# Altium schematic sheet power_PROTECTION.SchDoc: power_PROTECTION.SchDoc
size A4; Organization: Badgerloop; Address1: 133 Engineering Research; Address2: Building; Address3: Madison, WI 53715
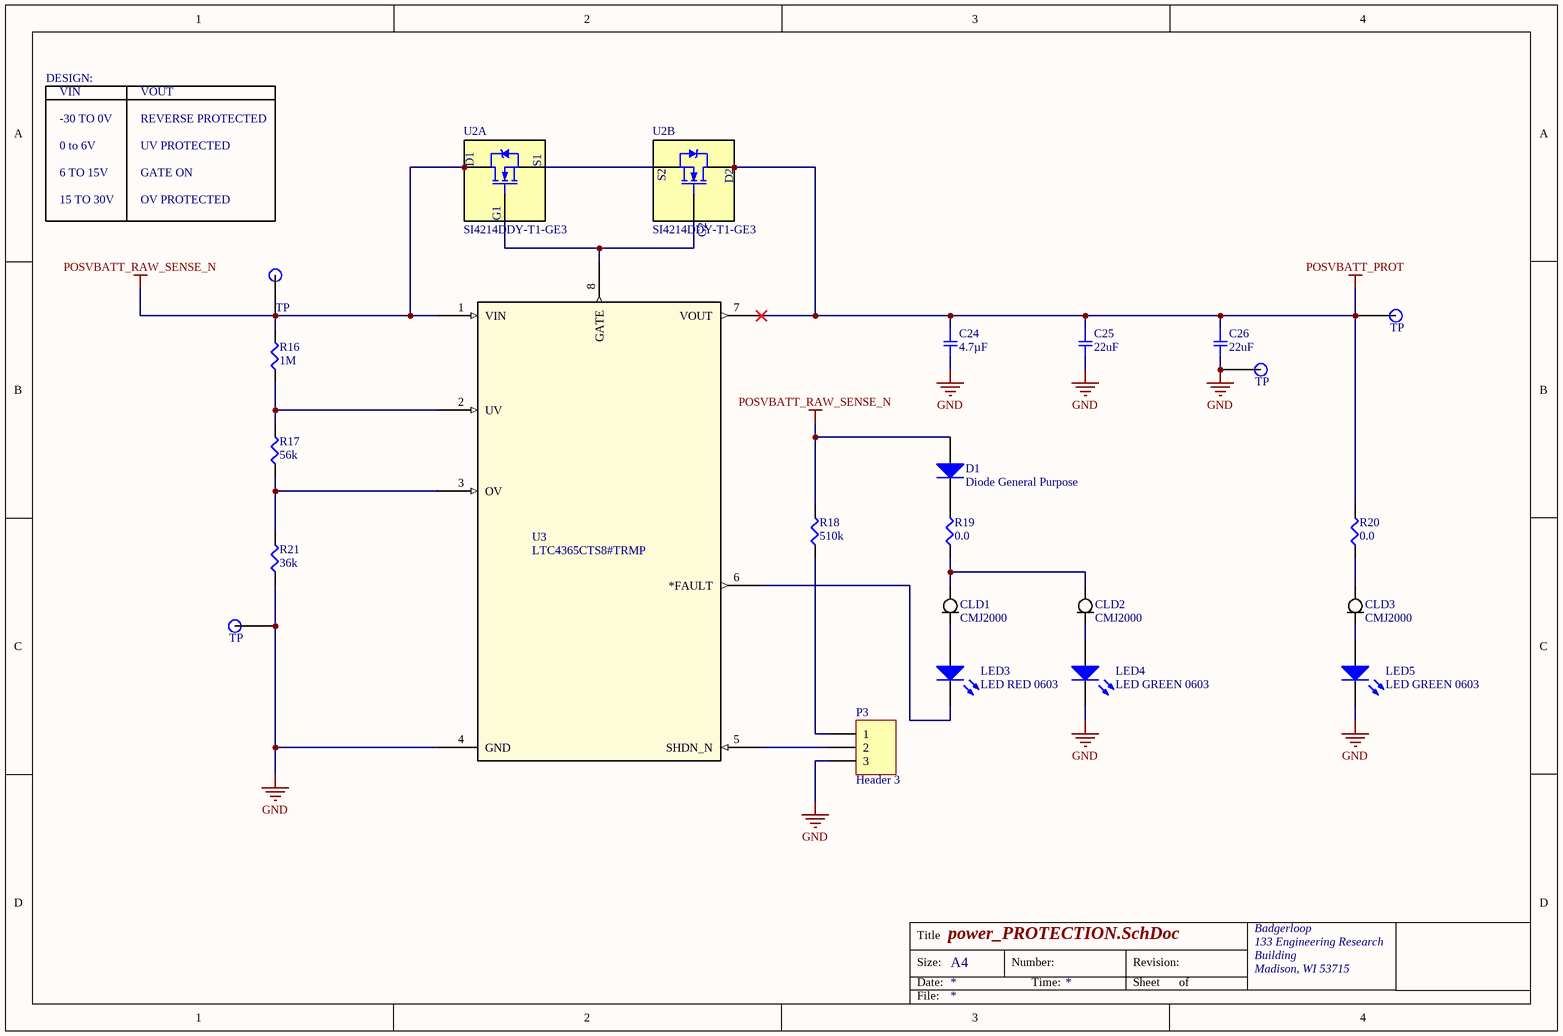
[diagram p0: power_PROTECTION.SchDoc]

## Parts
C24  4.7µF  [SMD-0805C]
C25  22uF  [SMD-0805C]
C26  22uF  [SMD-0805C]
CLD1  CMJ2000  [SODFL350X80-2N]
CLD2  CMJ2000  [SODFL350X80-2N]
CLD3  CMJ2000  [SODFL350X80-2N]
D1  Diode General Purpose  [Diode General Purpose]
LED3  LED RED 0603  [LED 0603 RED]
LED4  LED GREEN 0603  [LED 0603 GREEN]
LED5  LED GREEN 0603  [LED 0603 GREEN]
P3  Header 3  [Pin Header 1x3 TH Pitch 2.54mm]
R16  1M  [SMD-0402-RES]
R17  56k  [SMD-0402-RES]
R18  510k  [SMD-0402-RES]
R19  0.0  [SMD-0402-RES]
R20  0.0  [SMD-0402-RES]
R21  36k  [SMD-0402-RES]
TP9  TP  [Test Point]
TP10  TP  [Test Point]
TP11  TP  [Test Point]
TP13  TP  [Test Point]
U2  SI4214DDY-T1-GE3  [SOIC-8_SI-L]  (parts A,B of 2)
U3  LTC4365CTS8#TRMP  [TSOT-23_TS8]

## Nets
GND: C24.2 C25.2 C26.2 LED4.2(K) LED5.2(K) P3.3 R21.1 TP10.1 TP13.1 U3.4(GND)
POSVBATT_PROT: C24.1 C25.1 C26.1 R20.2 TP11.1 U2.5(D2) U2.6(D2) U3.7(VOUT)
POSVBATT_RAW_SENSE_N: D1.1(A) R16.2 R18.2 TP9.1 U2.7(D1) U2.8(D1) U3.1(VIN)
NetCLD1_1: CLD1.1 CLD2.1 R19.1
NetCLD1_2: CLD1.2 LED3.1(A)
NetCLD2_2: CLD2.2 LED4.1(A)
NetCLD3_1: CLD3.1 R20.1
NetCLD3_2: CLD3.2 LED5.1(A)
NetD1_2: D1.2(K) R19.2
NetLED3_2: LED3.2(K) U3.6(*FAULT)
NetP3_1: P3.1 R18.1
NetP3_2: P3.2 U3.5(SHDN_N)
NetR16_1: R16.1 R17.2 U3.2(UV)
NetR17_1: R17.1 R21.2 U3.3(OV)
NetU2_1: U2.1(S1) U2.3(S2)
NetU2_2: U2.2(G1) U2.4(G2) U3.8(GATE)

## Notes on the sheet
- DESIGN:
- VIN
- VOUT
- -30 TO 0V
- 0 to 6V
- 6 TO 15V
- REVERSE PROTECTED
- UV PROTECTED
- GATE ON
- 15 TO 30V
- OV PROTECTED
- Title
- Size:
- Date:
- A4
- Number:
- Time:
- Revision:
- Sheet
- of
- File:

## Library data of the parts
C24 = GRM21BR61H475KE51L: CAP CER 4.7UF 50V X5R 0805; Manufacturer: Murata Electronics North America; Factory Stock: 0; Unit Price (USD): 0.37; Minimum Quantity: 1; Tolerance: ±10%; Datasheets: http://www.murata.com/~/media/webrenewal/support/library/catalog/products/capacitor/mlcc/c02e.pdf; Image: //media.digikey.com/Renders/Murata%20Renders/0805%20(2012%20Metric)%20.85mm.jpg; Digi-Key Part Number: 490-10751-1-ND; Part Number: GRM21BR61H475KE51L; Quantity Available: 29522; @ qty: 0; Packaging: Cut Tape (CT); Series: GRM; Part Status: Active; Value: 4.7µF; Voltage: 50V; Temperature Coefficient: X5R; Operating Temperature: -55°C ~ 85°C; Features: -; Ratings: -; Applications: General Purpose; Mounting Type: Surface Mount, MLCC; Package / Case: 0805 (2012 Metric); Size / Dimension: 0.079" L x 0.049" W (2.00mm x 1.25mm); Height - Seated (Max): -; Thickness (Max): 0.055" (1.40mm); Lead Spacing: -; Lead Style: -
C25 C26 = GC321AD72E103KX01D: CAP CER 10000PF 250V X7T 0805; Part Number: C2012JB1V226M125AC; Manufacturer: TDK Corporation; Factory Stock: 10000; Unit Price (USD): 0.3; @ qty: 0; Minimum Quantity: 1; Tolerance: ±20%; Voltage: 35V; Temperature Coefficient: JB; Image: //media.digikey.com/Renders/Murata%20Renders/0805(GC3)200x125.jpg; Digi-Key Part Number: 445-11527-1-ND; Quantity Available: 4000; Packaging: Cut Tape (CT); Series: GC3; Part Status: Active; Value: 22uF; Operating Temperature: -55°C ~ 125°C; Features: -; Ratings: AEC-Q200; Applications: Automotive; Mounting Type: Surface Mount, MLCC; Package / Case: 0805; Size / Dimension: 0.079" L x 0.049" W (2.00mm x 1.25mm); Height - Seated (Max): -; Thickness (Max): 0.039" (1.00mm); Lead Spacing: -; Lead Style: -
CLD1-CLD3 = DIODE Current Limiting Single SM: Manufacturer: Central Semiconductor Corp; Manufacturer P/N: CMJ2000 TR; Vin Max: 100V; Current Output: 2mA; Do Not Populate: *; ComponentLink1Description: Digikey; ComponentLink1URL: https://www.digikey.com/product-detail/en/central-semiconductor-corp/CMJ2000-TR/CMJ2000CT-ND/5018676; Package / Case: SOD-123F; Digikey P/N: CMJ2000CT-ND
D1 = Diode General Purpose: DIODE GEN PURP 100V 150MA SOD123; Manufacturer: Micro Commercial Co; Manufacturer P/N: 1N4148W-TP; ComponentLink1Description: Digikey; ComponentLink1URL: https://www.digikey.com/product-detail/en/micro-commercial-co/1N4148W-TP/1N4148WTPMSTR-ND/717196; Digikey P/N: 1N4148WTPMSTR-ND; Package / Case: SOD123; Do Not Populate: *
LED3 = LED RED 0603: Red 631nm LED Indication - Discrete 2V 0603 (1608 Metric); Manufacturer: Lite-On Inc.; Manufacturer P/N: LTST-C190KRKT; Digikey P/N: 160-1436-1-ND; Package / Case: 0603; Color: RED
LED4 LED5 = LED GREEN 0603: Manufacturer: Lite-On Inc.; Manufacturer P/N: LTST-C190KGKT; Digikey P/N: 160-1435-1-ND; Package / Case: 0603; Color: GREEN
P3 = Header 3: Header, 3-Pin; LatestRevisionDate: 17-Jul-2002; LatestRevisionNote: Re-released for DXP Platform.; Publisher: Altium Limited
R16 = ERJ-2GEJ105X: RES SMD 1M OHM 5% 1/10W 0402; Manufacturer: Panasonic Electronic Components; Factory Stock: 0; Unit Price (USD): 0.00350; @ qty: 1500; Minimum Quantity: 1; Power (Watts): 0.1W, 1/10W; Temperature Coefficient: ±200ppm/°C; Part Number: ERJ-2GEJ105X; Datasheets: http://industrial.panasonic.com/www-cgi/jvcr13pz.cgi?E+PZ+3+AOA0001+ERJ2GEJ105X+7+WW; Image: //media.digikey.com/Photos/Panasonic%20Photos/ERJ-PA2-Series.jpg; Digi-Key Part Number: P1.0MJCT-ND; Quantity Available: 1082572; Packaging: Cut Tape (CT); Series: ERJ; Part Status: Active; Value: 1M; Tolerance: ±5%; Composition: Thick Film; Features: Automotive AEC-Q200; Operating Temperature: -55°C ~ 155°C; Package / Case: 0402 (1005 Metric); Supplier Device Package: 0402; Size / Dimension: 0.039" L x 0.020" W (1.00mm x 0.50mm); Height - Seated (Max): 0.016" (0.40mm); Number of Terminations: 2; Failure Rate: -
R17 = ERJ-2GEJ563X: RES SMD 56K OHM 5% 1/10W 0402; Manufacturer: Panasonic Electronic Components; Factory Stock: 0; Unit Price (USD): 0.00350; @ qty: 1500; Minimum Quantity: 1; Power (Watts): 0.1W, 1/10W; Temperature Coefficient: ±200ppm/°C; Part Number: ERJ-2GEJ563X; Datasheets: http://industrial.panasonic.com/www-cgi/jvcr13pz.cgi?E+PZ+3+AOA0001+ERJ2GEJ563X+7+WW; Image: //media.digikey.com/Photos/Panasonic%20Photos/ERJ-PA2-Series.jpg; Digi-Key Part Number: P56KJCT-ND; Quantity Available: 208344; Packaging: Cut Tape (CT); Series: ERJ; Part Status: Active; Value: 56k; Tolerance: ±5%; Composition: Thick Film; Features: Automotive AEC-Q200; Operating Temperature: -55°C ~ 155°C; Package / Case: 0402 (1005 Metric); Supplier Device Package: 0402; Size / Dimension: 0.039" L x 0.020" W (1.00mm x 0.50mm); Height - Seated (Max): 0.016" (0.40mm); Number of Terminations: 2; Failure Rate: -
R18 = ERJ-2GEJ514X: RES SMD 510K OHM 5% 1/10W 0402; Manufacturer: Panasonic Electronic Components; Factory Stock: 0; Unit Price (USD): 0.00350; @ qty: 1500; Minimum Quantity: 1; Power (Watts): 0.1W, 1/10W; Temperature Coefficient: ±200ppm/°C; Part Number: ERJ-2GEJ514X; Datasheets: http://industrial.panasonic.com/www-cgi/jvcr13pz.cgi?E+PZ+3+AOA0001+ERJ2GEJ514X+7+WW; Image: //media.digikey.com/Photos/Panasonic%20Photos/ERJ-PA2-Series.jpg; Digi-Key Part Number: P510KJCT-ND; Quantity Available: 151230; Packaging: Cut Tape (CT); Series: ERJ; Part Status: Active; Value: 510k; Tolerance: ±5%; Composition: Thick Film; Features: Automotive AEC-Q200; Operating Temperature: -55°C ~ 155°C; Package / Case: 0402 (1005 Metric); Supplier Device Package: 0402; Size / Dimension: 0.039" L x 0.020" W (1.00mm x 0.50mm); Height - Seated (Max): 0.016" (0.40mm); Number of Terminations: 2; Failure Rate: -
R19 R20 = ERJ-2GE0R00X: RES SMD 0.0OHM JUMPER 1/10W 0402; Manufacturer: Panasonic Electronic Components; Factory Stock: 0; Unit Price (USD): 0.00384; @ qty: 1500; Minimum Quantity: 1; Power (Watts): 0.1W, 1/10W; Part Number: ERJ-2GE0R00X; Datasheets: http://industrial.panasonic.com/www-cgi/jvcr13pz.cgi?E+PZ+3+AOA0001+ERJ2GE0R00X+7+WW; Image: //media.digikey.com/Photos/Panasonic%20Photos/ERJ-PA2-Series.jpg; Digi-Key Part Number: P0.0JCT-ND; Quantity Available: 3152483; Packaging: Cut Tape (CT); Series: ERJ; Part Status: Active; Value: 0.0; Tolerance: Jumper; Composition: Thick Film; Features: Automotive AEC-Q200; Temperature Coefficient: -; Operating Temperature: -55°C ~ 155°C; Package / Case: 0402 (1005 Metric); Supplier Device Package: 0402; Size / Dimension: 0.039" L x 0.020" W (1.00mm x 0.50mm); Height - Seated (Max): 0.016" (0.40mm); Number of Terminations: 2; Failure Rate: -
R21 = ERJ-2RKF3602X: RES SMD 36K OHM 1% 1/10W 0402; Manufacturer: Panasonic Electronic Components; Factory Stock: 0; Unit Price (USD): 0.00496; @ qty: 1500; Minimum Quantity: 1; Power (Watts): 0.1W, 1/10W; Temperature Coefficient: ±100ppm/°C; Part Number: ERJ-2RKF3602X; Datasheets: http://industrial.panasonic.com/www-cgi/jvcr13pz.cgi?E+PZ+3+AOA0002+ERJ2RKF3602X+7+WW; Image: //media.digikey.com/Photos/Panasonic%20Photos/ERJ-PA2-Series.jpg; Digi-Key Part Number: P36.0KLCT-ND; Quantity Available: 208341; Packaging: Cut Tape (CT); Series: ERJ; Part Status: Active; Value: 36k; Tolerance: ±1%; Composition: Thick Film; Features: Automotive AEC-Q200; Operating Temperature: -55°C ~ 155°C; Package / Case: 0402 (1005 Metric); Supplier Device Package: 0402; Size / Dimension: 0.039" L x 0.020" W (1.00mm x 0.50mm); Height - Seated (Max): 0.016" (0.40mm); Number of Terminations: 2; Failure Rate: -
U2 = SI4214DDY-T1-GE3: Mosfet Array 2 N-Channel (Dual) 30V 8.5A 3.1W Surface Mount 8-SO; Vendor: Vishay; Rds(on): 0.0195; I_D (A): 8.5; Manufacturer_Part_Number: SI4214DDY-T1-GE3; RefDes: U; Type: DEV; Value: Value; Digikey P/N: SI4214DDY-T1-GE3CT-ND; ComponentLink1Description: Digikey; ComponentLink1URL: https://www.digikey.com/product-detail/en/vishay-siliconix/SI4214DDY-T1-GE3/SI4214DDY-T1-GE3CT-ND/3305376; V_DS: 30V; ComponentLink2Description: Datasheet; ComponentLink2URL: http://www.vishay.com/docs/67907/si4214ddy-t1-e3.pdf
U3 = LTC4365CTS8#TRMP: Overvoltage, / Undervoltage and Reverse / Supply Protection Controller; Manufacturer_Part_Number: LTC4365CTS8#TRMPBF; Vendor: Linear Technology; RefDes: RefDes; Type: DEV; Value: Value; Supplier 1: Digi-Key; Supplier Part Number 1: LTC4365CTS8#TRMPBFDKR-ND